# EasyEDA Pro project RCkid.epro, board Cartridge
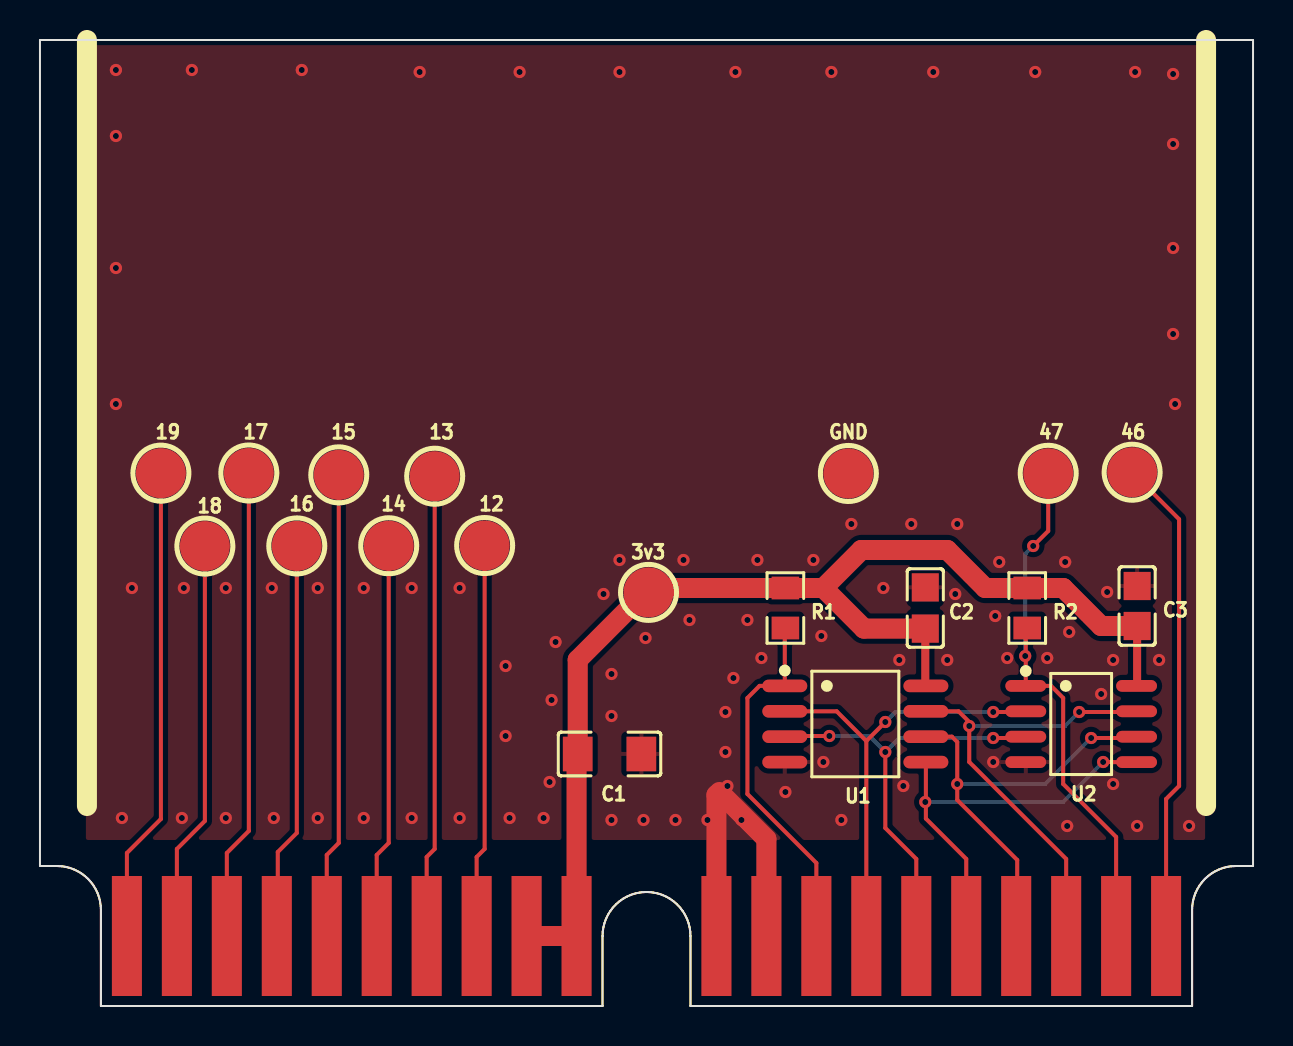
[diagram p30: board, top side]
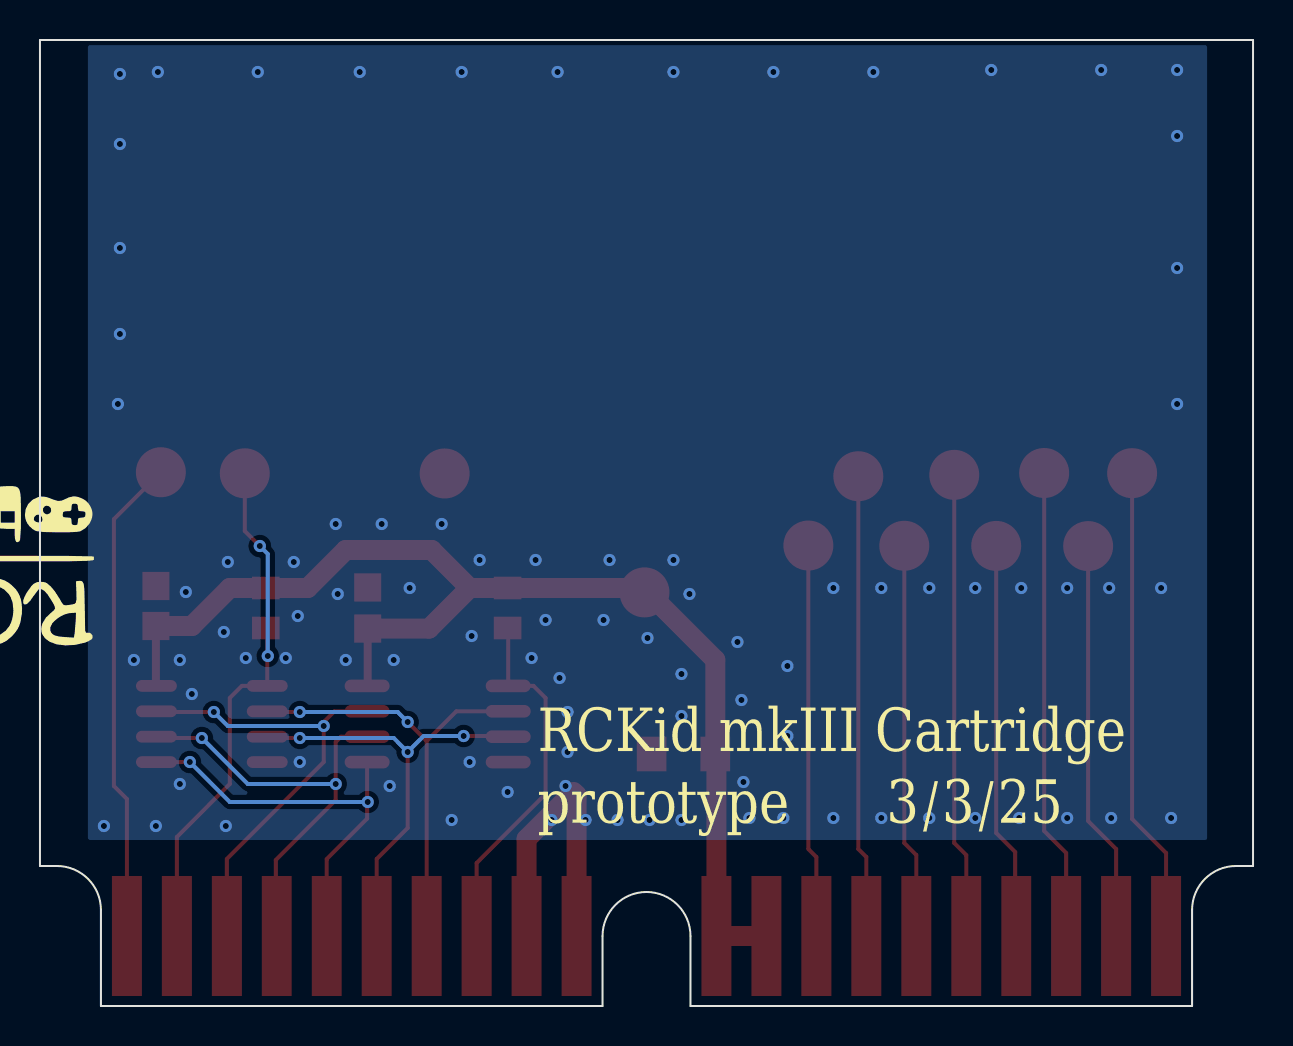
[diagram p31: board, bottom side, seen from below]

Outline 60.7 x 48.3 mm; copper layers: Top Layer, Bottom Layer. Coordinates in mm from the lower left corner of the outline.
Outline path: 0,48.3 0,7 0.85,7 arc(2.41,6.36) 3.05,4.8 3.05,0 28.15,0 28.15,3.5 arc(30.35,5.7) 32.55,3.5 32.55,0 57.65,0 57.65,4.8 arc(58.29,6.36) 59.85,7 60.7,7 60.7,48.3 0,48.3
Stack: Top Layer 0.035mm / Dielectric1 1.51mm FR4 er 4.5 / Bottom Layer 0.035mm

## Design rules (mm)
template: JLCPCB Capability(Two Layers Board)
spacing copperThickness1oz (default): track to track 0.102, other pairs 0.152 to 0.3
spacing copperThickness2oz: track to track 0.203, other pairs 0.152 to 0.3
track width copperThickness1oz (default): min 0.127, default 0.254, max 2.54
track width copperThickness2oz: min 0.203, default 0.254, max 2.54
differential pair differentialPair (default): width min 0.127, default 0.254, max 2.54; gap min 0.152, default 0.152
via viaSize (default): diameter min 0.5, default 0.61, max 10; hole min 0.3, default 0.305, max 6.3

## Placement (name value [footprint] x y rotation side)
3v3  -  [TEST-SMD_BD1.9-L4.2]  30.45 20.68 0 top
12  -  [TEST-SMD_BD1.9-L4.2]  22.25 23.02 0 top
13  -  [TEST-SMD_BD1.9-L4.2]  19.75 26.49 0 top
14  -  [TEST-SMD_BD1.9-L4.2]  17.45 23.01 0 top
15  -  [TEST-SMD_BD1.9-L4.2]  14.95 26.56 0 top
16  -  [TEST-SMD_BD1.9-L4.2]  12.85 23 0 top
17  -  [TEST-SMD_BD1.9-L4.2]  10.45 26.65 0 top
18  -  [TEST-SMD_BD1.9-L4.2]  8.25 23 0 top
19  -  [TEST-SMD_BD1.9-L4.2]  6.05 26.64 0 top
46  -  [TEST-SMD_BD1.9-L4.2]  54.65 26.69 0 top
47  -  [TEST-SMD_BD1.9-L4.2]  50.45 26.63 0 top
C1  100uF  [C1206]  28.5 12.6 180 top
C2  100nF  [C0805#2]  44.3 19.9 270 top
C3  2.2uF  [C0805]  54.9 20 270 top
CONN1  -  [RCKid Cartridge Pins]  30.35 3.5 0 top
GND  -  [TEST-SMD_BD1.9-L4.2]  40.45 26.63 0 top
R1  10kΩ  [R0805]  37.3 19.9 90 top
R2  100kΩ  [R0805]  49.4 19.9 90 top
U1  W25Q128JVSIQTR -YJLTY  [SOIC-8_L5.3-W5.3-P1.27-LS8.0-BL]  40.8 14.1 270 top
U2  APS6404L-3SQR-SN  [SOIC-8_L4.9-W3.9-P1.27-LS6.0-BL]  52.1 14.1 270 top

## Footprints (pads in the part's own frame, mm; a bottom-side part is the same pattern mirrored in y, then rotated)
C0805
  rect 1.41x1.35 smd: 1(-1,0) 2(1,0)
C0805#2
  rect 1.41x1.35 smd: 1(-1.03,0) 2(1.03,0)
C1206
  rect 1.485x1.728 smd: 1(-1.593,0) 2(1.593,0)
R0805
  rect 1.133x1.377 smd: 1(-1,0) 2(1,0)
RCKid Cartridge Pins
  rect 1.5x6 smd: 1(-26,0) 2(-23.5,0) 3(-21,0) 4(-18.5,0) 5(-16,0) 6(-13.5,0) 7(-11,0) 8(-8.5,0) 9(-6,0) 10(-3.5,0) 11(3.5,0) 12(6,0) 13(8.5,0) 14(11,0) 15(13.5,0) 16(16,0) 17(18.5,0) 18(21,0) 19(23.5,0) 20(26,0)
SOIC-8_L4.9-W3.9-P1.27-LS6.0-BL
  oval 0.588x2.045 smd: 1(-1.905,-2.772) 2(-0.635,-2.772) 3(0.635,-2.772) 4(1.905,-2.772) 5(1.905,2.772) 6(0.635,2.772) 7(-0.635,2.772) 8(-1.905,2.772)
SOIC-8_L5.3-W5.3-P1.27-LS8.0-BL
  oval 0.63x2.25 smd: 1(-1.905,-3.53) 2(-0.635,-3.53) 3(0.635,-3.53) 4(1.905,-3.53) 5(1.905,3.53) 6(0.635,3.53) 7(-0.635,3.53) 8(-1.905,3.53)
TEST-SMD_BD1.9-L4.2
  round 2.5 smd: 1(0,0)

## Nets
As in the schematic.

## Via types
v1: diameter 0.61, hole 0.305, Top Layer to Bottom Layer, 102 vias

## Routing (per net, layer and track width the routed paths; a pad name or vN(x,y) marks a point on that pad's centre or on a via; arc(x,y) is an arc through that point)
3V3: length 60
  Top Layer w0.4: C2.2 44.3,16.04 U1.8 ; C3.2 54.9,16.03 U2.8
  Top Layer w1: 39.2,20.9 41.1,22.8 45.4,22.8 47.3,20.9 R2.2 51.2,20.9 53.1,19 C3.2 ; 39.2,20.9 41.23,18.87 C2.2 ; 39.2,20.9 R1.2 30.5,20.9 26.91,17.31 C1.2 26.85,12.54 CONN1.10 CONN1.9
GND: length 15.3
  Top Layer w1: CONN1.12 36.35,8.35 34,10.7 ; 33.9,10.6 33.85,10.55 CONN1.11
  vias: v1(3.8,46.8) v1(3.8,43.5) v1(3.8,36.9) v1(3.8,30.1) v1(4.1,9.4) v1(4.6,20.9) v1(7.1,9.4) v1(7.2,20.9) v1(7.6,46.8) v1(9.3,20.9) v1(9.3,9.4) v1(11.6,20.9) v1(11.7,9.4) v1(13.1,46.8) v1(13.9,20.9) v1(13.9,9.4) v1(16.2,20.9) v1(16.2,9.4) v1(18.6,20.9) v1(18.6,9.4) v1(19,46.7) v1(21,20.9) v1(21,9.4) v1(23.3,17) v1(23.3,13.5) v1(23.5,9.4) v1(24,46.7) v1(25.2,9.4) v1(25.5,11.2) v1(25.6,15.3) v1(25.8,18.2) v1(28.2,20.6) v1(28.6,16.6) v1(28.6,14.5) v1(28.6,9.3) v1(29,46.7) v1(29,22.3) v1(30.2,9.3) v1(30.3,18.4) v1(31.8,9.3) v1(32.2,22.3) v1(32.5,19.3) v1(33.4,9.3) v1(34.3,14.7) v1(34.3,12.7) v1(34.4,11) v1(34.7,16.4) v1(34.8,46.7) v1(35.1,9.3) v1(35.4,19.3) v1(35.9,22.3) v1(36.1,17.4) v1(37.3,10.7) v1(38.7,22.3) v1(39.1,18.5) v1(39.2,12.2) v1(39.6,46.7) v1(40.1,9.3) v1(40.6,24.1) v1(42.2,20.9) v1(43,17.3) v1(43.2,11) v1(43.6,24.1) v1(44.7,46.7) v1(45.4,17.3) v1(45.8,20.6) v1(45.9,24.1) v1(47.7,12.2) v1(47.8,19.5) v1(48,22.2) v1(48.4,17.4) v1(49.8,46.7) v1(50.4,17.4) v1(51.3,22.2) v1(51.4,9) v1(51.5,18.7) v1(53.1,15.6) v1(53.4,20.7) v1(53.7,17.3) v1(53.7,11.1) v1(54.8,46.7) v1(54.9,9) v1(56,17.3) v1(56.7,46.6) v1(56.7,43.1) v1(56.7,37.9) v1(56.7,33.6) v1(56.8,30.1) v1(57.5,9)
GPIO_12: length 19.7
  Top Layer w0.2: 12.1 22.25,7.85 21.85,7.45 CONN1.8
GPIO_13: length 23.2
  Top Layer w0.2: 13.1 19.75,7.85 19.35,7.45 CONN1.7
GPIO_14: length 19.8
  Top Layer w0.2: CONN1.6 16.85,7.55 17.45,8.15 14.1
GPIO_15: length 23.3
  Top Layer w0.2: CONN1.5 14.35,7.55 14.95,8.15 15.1
GPIO_16: length 19.9
  Top Layer w0.2: CONN1.4 11.85,6.05 11.9,6.1 11.9,7.7 12.85,8.65 16.1
GPIO_17: length 23.6
  Top Layer w0.2: CONN1.3 9.35,7.65 10.45,8.75 17.1
GPIO_18: length 20.1
  Top Layer w0.2: CONN1.2 6.85,7.85 8.25,9.25 18.1
GPIO_19: length 23.8
  Top Layer w0.2: CONN1.1 4.35,7.65 6.05,9.35 19.1
GPIO_46: length 24.4
  Top Layer w0.2: CONN1.20 56.35,10.35 57,11 57,24.34 46.1
GPIO_47: length 27.7
  Top Layer w0.2: 47.1 50.45,23.75 v1(49.7,23) ; R2.1 49.33,18.83 U2.1 50.59,16.01 51.2,15.4 51.2,11.1 53.85,8.45 CONN1.19
  Bottom Layer w0.2: v1(49.3,17.5) 49.3,22.6 v1(49.7,23)
QSPI_SCLK: length 22.6
  Top Layer w0.2: v1(52.6,13.4) 54.81,13.4 U2.6 ; U1.6 45.63,13.47 45.9,13.2 v1(45.9,11.1) 45.9,10.3 48.9,7.3 48.9,3.55 CONN1.17
  Bottom Layer w0.2: v1(52.6,13.4) 50.3,11.1 v1(45.9,11.1)
QSPI_SD0: length 20.9
  Top Layer w0.2: U1.5 44.33,9.37 46.35,7.35 CONN1.16 ; U2.5 53.65,12.2 53.65,12.2 v1(53.2,12.2)
  Bottom Layer w0.2: v1(53.2,12.2) 51.2,10.2 v1(44.3,10.2)
QSPI_SD1: length 23
  Top Layer w0.2: U1.2 39.87,14.74 41.35,13.25 ; U2.2 49.29,14.7 v1(47.7,14.7) ; 41.35,13.25 v1(42.3,14.2) ; 41.35,13.25 CONN1.14
  Bottom Layer w0.2: v1(47.7,14.7) 42.8,14.7 v1(42.3,14.2)
QSPI_SD2: length 22.6
  Top Layer w0.2: CONN1.15 43.85,7.35 42.3,8.9 v1(42.3,12.7) ; U2.3 49.26,13.4 v1(47.7,13.4) ; U1.3 37.31,13.5 v1(39.5,13.5)
  Bottom Layer w0.2: v1(47.7,13.4) 43,13.4 v1(42.3,12.7) 41.5,13.5 v1(39.5,13.5)
QSPI_SD3: length 23.8
  Top Layer w0.2: v1(52,14.7) 54.84,14.7 U2.7 ; U1.7 45.97,14.74 46.5,14.2 46.5,12.2 51.35,7.35 CONN1.18
  Bottom Layer w0.2: v1(46.5,14) 51.3,14 v1(52,14.7)
QSPI_SS: length 18.4
  Top Layer w0.2: R1.1 37.27,18.87 U1.1 36,16.01 35.4,15.4 35.4,10.6 38.85,7.15 CONN1.13

## Copper pours and planes (outline as drawn; the poured copper is in the pictures)
GND on Top Layer: 2.3,48.3 58.3,48.3 58.3,8.3 2.3,8.3
GND on Bottom Layer: 2.3,48.3 58.3,48.3 58.3,8.3 2.3,8.3

## Text on the board
Bottom Silkscreen Layer: RCKid mkIII Cartridge / prototype      3/3/25
